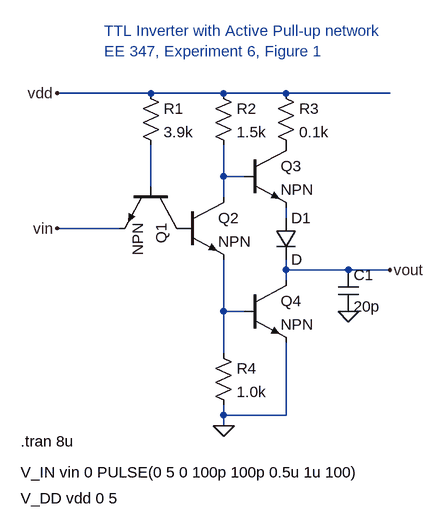
[diagram p0: schematic TTL_inverter_with_active_pullup_6_1.asc]
TTL_inverter_with_active_pullup_6_1.asc, the LTspice schematic file:
Version 4
SHEET 1 880 772
WIRE 128 64 -16 64
WIRE 240 64 128 64
WIRE 336 64 240 64
WIRE 496 64 336 64
WIRE 240 192 240 144
WIRE 272 192 240 192
WIRE 128 208 128 144
WIRE 240 224 240 192
WIRE 336 256 336 240
WIRE 80 272 -16 272
WIRE 336 336 336 320
WIRE 432 336 336 336
WIRE 496 336 432 336
WIRE 336 352 336 336
WIRE 240 400 240 320
WIRE 272 400 240 400
WIRE 240 464 240 400
WIRE 240 560 240 544
WIRE 336 560 336 448
WIRE 336 560 240 560
WIRE 240 576 240 560
FLAG 240 576 0
FLAG -16 272 vin
FLAG -16 64 vdd
FLAG 496 336 vout
FLAG 432 400 0
SYMBOL res 112 48 R0
SYMATTR InstName R1
SYMATTR Value 3.9k
SYMBOL res 224 48 R0
SYMATTR InstName R2
SYMATTR Value 1.5k
SYMBOL res 320 48 R0
SYMATTR InstName R3
SYMATTR Value 0.1k
SYMBOL npn 176 208 R90
SYMATTR InstName Q1
SYMBOL npn 176 224 R0
SYMATTR InstName Q2
SYMBOL npn 272 144 R0
SYMATTR InstName Q3
SYMBOL npn 272 352 R0
SYMATTR InstName Q4
SYMBOL res 224 448 R0
SYMATTR InstName R4
SYMATTR Value 1.0k
SYMBOL diode 320 256 R0
SYMATTR InstName D1
SYMBOL cap 416 336 R0
SYMATTR InstName C1
SYMATTR Value 20p
TEXT -72 688 Left 2 !V_DD vdd 0 5
TEXT -72 600 Left 2 !.tran 8u
TEXT -72 648 Left 2 !V_IN vin 0 PULSE(0 5 0 100p 100p 0.5u 1u 100)
TEXT 56 -32 Left 2 ;TTL Inverter with Active Pull-up network\nEE 347, Experiment 6, Figure 1

The netlist it stands for:
* TTL_inverter_with_active_pullup_6_1.asc
R1 vdd N002 3.9k
R2 vdd N001 1.5k
R3 vdd P001 0.1k
Q1 P002 N002 vin 0 NPN
Q2 N001 P002 N004 0 NPN
Q3 P001 N001 N003 0 NPN
Q4 vout N004 0 0 NPN
R4 N004 0 1.0k
D1 N003 vout D
C1 vout 0 20p
.model D D
.lib standard.dio
.model NPN NPN
.model PNP PNP
.lib standard.bjt
V_DD vdd 0 5
.tran 8u
V_IN vin 0 PULSE(0 5 0 100p 100p 0.5u 1u 100)
* TTL Inverter with Active Pull-up network
* EE 347, Experiment 6, Figure 1
.backanno
.end